# EAGLE design controller7connector (EAGLE 7.7.0)
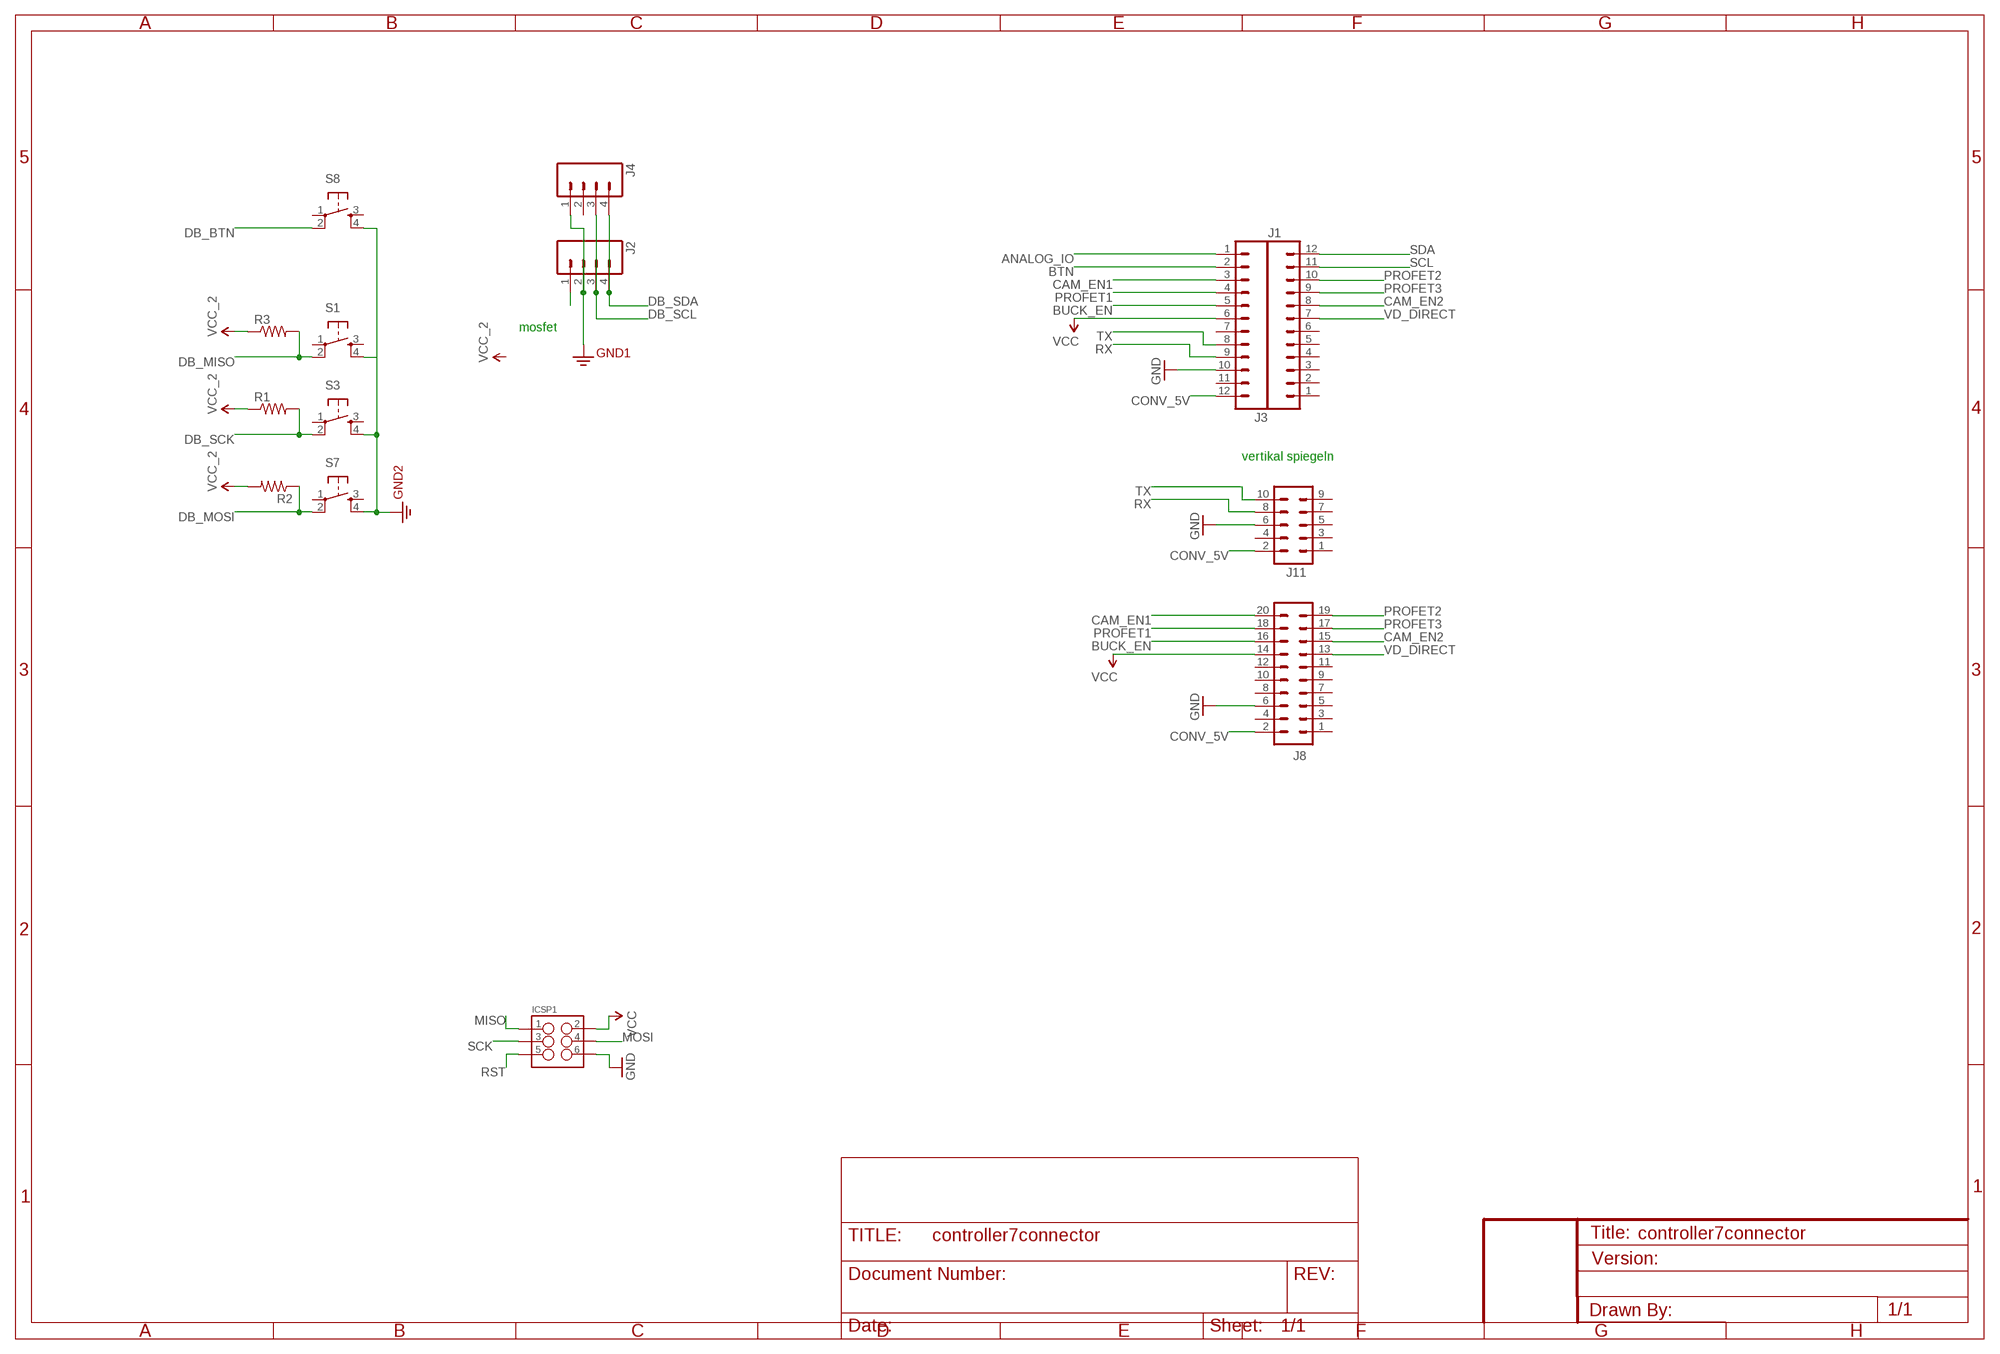
[diagram p0: schematic, sheet 1]

## Parts
ICSP1  M03X2FEMALE  [2X3]
J1  M12PTH  [1X12]
J2  M04LOCK  [1X04_LOCK]
J3  M12PTH  [1X12]
J4  M04LOCK  [1X04_LOCK]
J8  M10X2  [2X10]
J11  M05X2NO_SILK  [2X5_NOSILK]
R1  RESISTOR1206  [1206]
R2  RESISTOR1206  [1206]
R3  RESISTOR1206  [1206]
S1  TAC_SWITCHPTH  [TACTILE-PTH]
S3  TAC_SWITCHPTH  [TACTILE-PTH]
S7  TAC_SWITCHPTH  [TACTILE-PTH]
S8  TAC_SWITCHPTH  [TACTILE-PTH]

## Nets
3.3V [power]: J2.2 J4.1 S1.4 S3.4 S7.4 S8.4 ; supply symbol labelled GND2
ANALOG_IO: J3.1
BTN: J3.2
BUCK_EN: J3.5 J8.16
CAM_EN1: J3.3 J8.20
CAM_EN2: J1.8 J8.15
CONV_5V [power]: J3.12 J8.2 J11.2
DB_BTN: S8.2
DB_MISO: R3.2 S1.2
DB_MOSI: R2.1 S7.2
DB_SCK: R1.2 S3.2
DB_SCL: J2.3 J4.3
DB_SDA: J2.4 J4.4
GND [power]: ICSP1.6 J3.10 J8.6 J11.6
MISO: ICSP1.1
MOSI: ICSP1.4
N$1 [camera_power]: J2.1
PROFET1: J3.4 J8.18
PROFET2: J1.10 J8.19
PROFET3: J1.9 J8.17
RST: ICSP1.5
RX: J3.9 J11.8
SCK: ICSP1.3
SCL: J1.11
SDA: J1.12
TX: J3.8 J11.10
VCC [power]: ICSP1.2 J3.6 J8.14
VCC_2 [power]: R1.1 R2.2 R3.1
VD_DIRECT: J1.7 J8.13
Unconnected: J1.1 J1.2 J1.3 J1.4 J1.5 J1.6 J3.7 J3.11 J4.2 J8.1 J8.3 J8.4 J8.5 J8.7 J8.8 J8.9 J8.10 J8.11 J8.12 J11.1 J11.3 J11.4 J11.5 J11.7 J11.9 S1.1 S1.3 S3.1 S3.3 S7.1 S7.3 S8.1 S8.3

## Notes on the sheet
- mosfet
- vertikal spiegeln

## Library data of the parts
ICSP1 = SparkFun-Connectors:M03X2: 2x3 .1" header. Shrouded, with keying- CONN-10681 SMT- CONN-11415 Pogo pins- HW-11044; PROD_ID: CONN-11566; VALUE: FEMALE 2x3
J1 J3 = SparkFun-Connectors:M12: Header 12 Standard 12-pin 0.1" header. Use with straight break away headers (SKU : PRT-00116), right angle break away headers (PRT-00553), swiss pins (PRT-00743), machine pins (PRT-00117), and female headers (PRT-00115).
J2 J4 = SparkFun-Connectors:M04: Header 4 Standard 4-pin 0.1" header. Use with straight break away headers (SKU : PRT-00116), right angle break away headers (PRT-00553), swiss pins (PRT-00743), machine pins (PRT-00117), and female headers (PRT-00115). Molex polarized connector foot print use with SKU : PRT-08231 with associated crimp pins and housings. 1MM SMD Version SKU: PRT-10208; PROD_ID: CONN-09696
J8 = SparkFun-Connectors:M10X2: This was SPECIALLY designed to be used with our Graphic LCD Backpack. Be sure you want to use this! It is not only staggered on each line of header holes, but IT IS ALSO offset of the center point of the top and bottom lines by 5 mil. This causes the headers to lock into place on the "standard" footprint on the LCD screen. The extra squares on the tdocu layer are there simply to reference other pins (if you were to actually populate a longer header than ten long - this is what we do with the backpacks).
J11 = SparkFun-Connectors:M05X2: Header 5x2 Standard 10-pin dual row 0.1" header. Commonly used with AVR-ISP. Use with Spark Fun Electronics SKU: PRT-00778
R1-R3 = SparkFun-Passives:RESISTOR: Resistor Basic schematic elements and footprints for 0603, 1206, and PTH resistors.
S1 S3 S7 S8 = SparkFun-Retired:TAC_SWITCH: Momentary Switch Button commonly used for reset or general input. Spark Fun Electronics SKU : COM-00097 SMT- SWCH-08247

## Net classes
0 default: width 0.254 mm, clearance 0.254 mm
1 power: width 0.356 mm, clearance 0.254 mm
2 camera_power: width 0.66 mm, clearance 0.254 mm
3 usbsignal: width 0.254 mm, clearance 0.203 mm

## Board
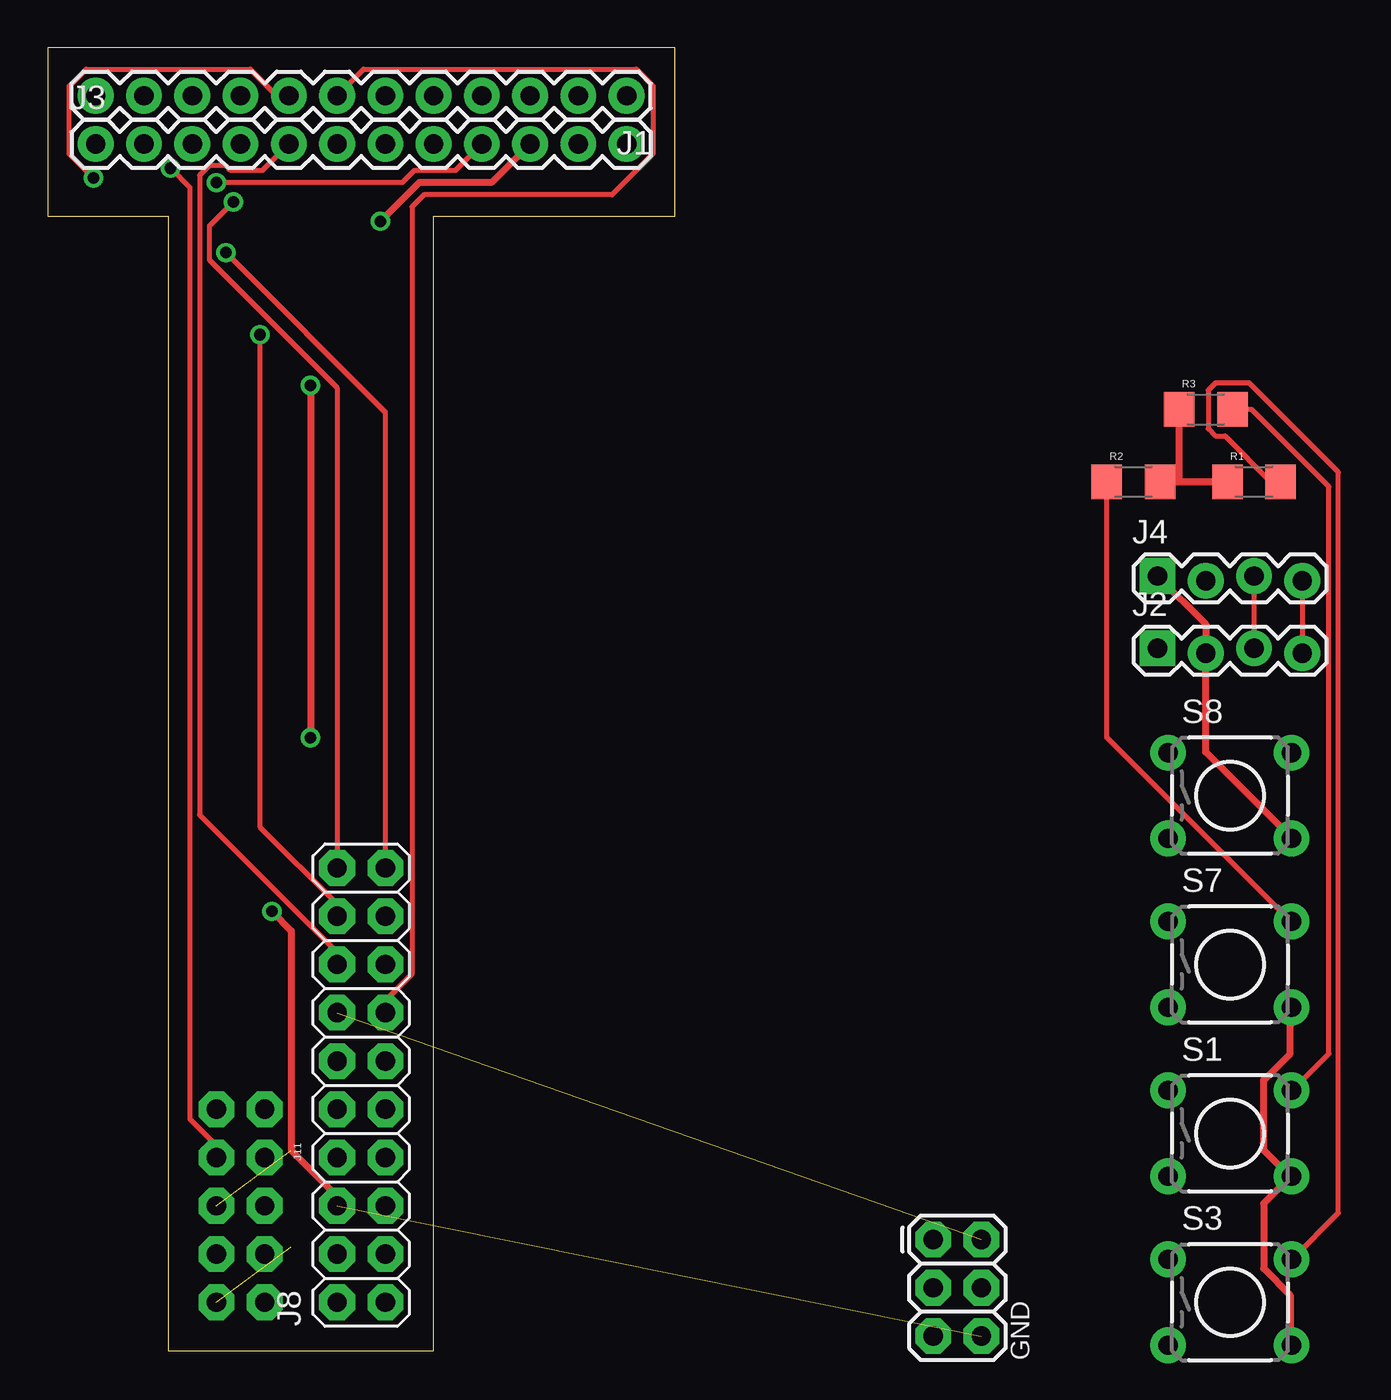
[diagram p1: board, top side]
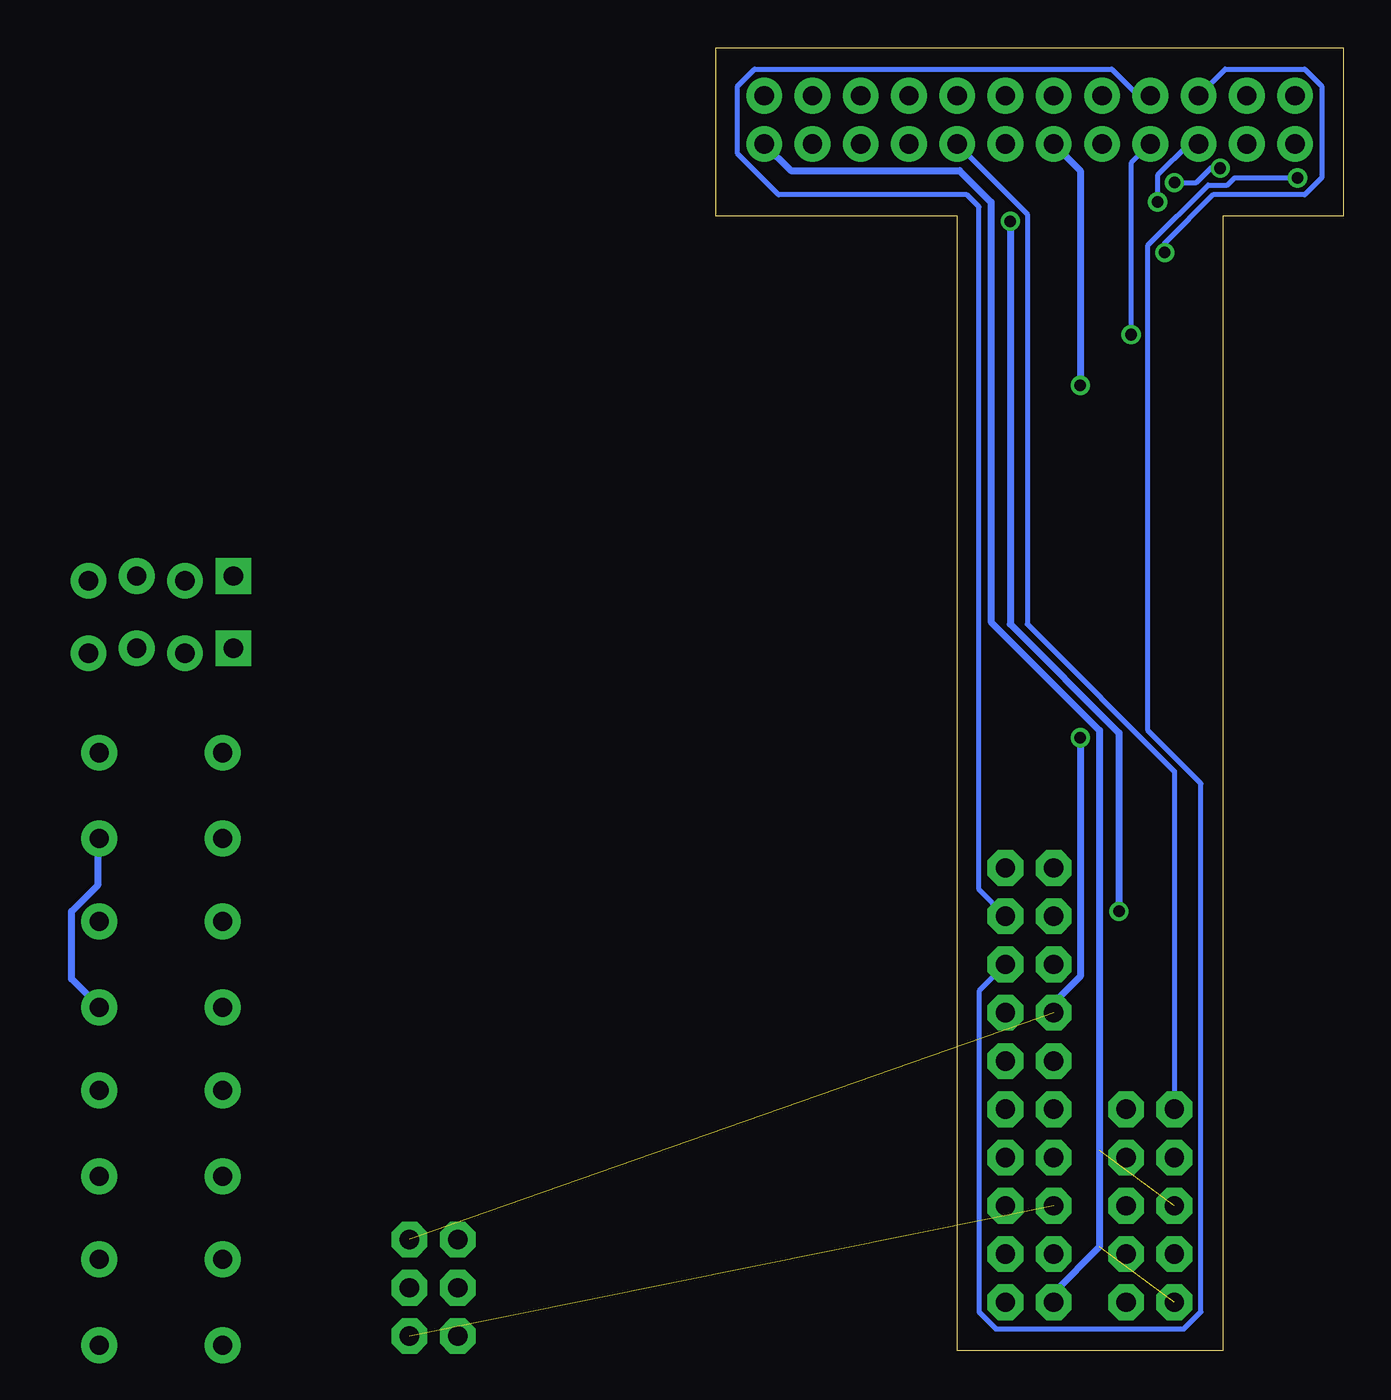
[diagram p2: board, bottom side, seen from below]

Size 33.02 x 68.58 mm. Coordinates in mm from the lower left corner, seen from the top.
Outline: 33.02,68.58 0,68.58 0,59.69 6.35,59.69 6.35,0 20.32,0 20.32,59.69 33.02,59.69 33.02,68.58
Copper layers (1*16): Top 0.035mm / dielectric 1.5mm / Bottom 0.035mm
Design rules "default": minimum track width 10mil, minimum drill 24mil, track to track 8mil, track to pad 8mil, pad to pad 8mil, via to via 8mil, smd to smd 8mil, copper to edge 40mil, drill to drill 8mil, minimum pad ring 10mil, minimum via ring 8mil, stop-mask expansion 4mil, vias tented up to drill 0mil, thermal gap 10mil

### Footprints (pad centres in the part's own frame; a part is rotated, then mirrored left to right if it is on the bottom)
2X3 = drill 1.016 pad 1.88 octagon: 1 0,0; 2 0,2.54; 3 2.54,0; 4 2.54,2.54; 5 5.08,0; 6 5.08,2.54
1X12 = drill 1.016 pad 1.88: 1 0,0; 2 2.54,0; 3 5.08,0; 4 7.62,0; 5 10.16,0; 6 12.7,0; 7 15.24,0; 8 17.78,0; 9 20.32,0; 10 22.86,0; 11 25.4,0; 12 27.94,0
1X04_LOCK = drill 1.016 pad 1.88 square: 1 0,0.127 | drill 1.016 pad 1.88: 2 2.54,-0.127; 3 5.08,0.127; 4 7.62,-0.127
2X10 = drill 1.016 pad 1.88 octagon: 1 -11.43,-1.27; 2 -11.43,1.27; 3 -8.89,-1.27; 4 -8.89,1.27; 5 -6.35,-1.27; 6 -6.35,1.27; 7 -3.81,-1.27; 8 -3.81,1.27; 9 -1.27,-1.27; 10 -1.27,1.27; 11 1.27,-1.27; 12 1.27,1.27; 13 3.81,-1.27; 14 3.81,1.27; 15 6.35,-1.27; 16 6.35,1.27; 17 8.89,-1.27; 18 8.89,1.27; 19 11.43,-1.27; 20 11.43,1.27
2X5_NOSILK = drill 1.016 pad 1.88 octagon: 1 -1.27,5.08; 2 1.27,5.08; 3 -1.27,2.54; 4 1.27,2.54; 5 -1.27,0; 6 1.27,0; 7 -1.27,-2.54; 8 1.27,-2.54; 9 -1.27,-5.08; 10 1.27,-5.08
1206 = smd 1.6 x 1.8: 1 -1.4,0; 2 1.4,0
TACTILE-PTH = drill 1.016 pad 1.88: 1 -3.251,2.261; 2 3.251,2.261; 3 -3.251,-2.261; 4 3.251,-2.261

### Placement (x,y rotation side)
ICSP1  46.61,5.84 270 top  (outside the outline)
J1  30.48,66.04 180 top
J2  58.42,36.83 0 top  (outside the outline)
J3  2.54,63.5 0 top
J4  58.42,40.64 0 top  (outside the outline)
J8  16.51,13.97 90 top
J11  10.16,7.62 180 top
R1  63.5,45.72 0 top  (outside the outline)
R2  57.15,45.72 0 top  (outside the outline)
R3  60.96,49.53 0 top  (outside the outline)
S1  62.23,11.43 0 top  (outside the outline)
S3  62.23,2.54 0 top  (outside the outline)
S7  62.23,20.32 0 top  (outside the outline)
S8  62.23,29.21 0 top  (outside the outline)

### Tracks (layer width: path | path; a pad name or v marks a point on that pad's centre or on a via)
3.3V
  Top 0.356: J4.1 60.96,38.23 J2.2 60.96,31.5 65.41,27.05 S8.4 | S3.4 65.41,0.38 65.41,2.92 64.01,4.32 64.01,7.75 65.41,9.14 S1.4 65.28,9.27 64.01,10.54 64.01,14.22 65.41,15.62 65.41,18.03 S7.4
  Bottom 0.356: S8.4 65.53,26.92 65.53,24.51 66.93,23.11 66.93,19.56 65.53,18.16 S7.4
BUCK_EN
  Top 0.254: J8.16 15.24,20.95 8,28.19 8,61.85 8.51,62.36 9.4,62.36 9.65,62.1 11.3,62.1 J3.5
CAM_EN1  (via drill 0.61)
  Top 0.254: J8.20 15.24,50.67 8.51,57.4 8.51,59.18 v9.78,60.45
  Bottom 0.254: v9.78,60.45 9.78,61.85 8.13,63.5 J3.3
CAM_EN2  (via drill 0.61)
  Top 0.254: J1.8 12.07,66.04 10.67,67.44 2.03,67.44 1.14,66.55 1.14,62.99 v2.41,61.72
  Bottom 0.254: v2.41,61.72 5.71,61.72 6.1,61.34 7.11,61.34 10.29,58.17 10.29,32.64 7.49,29.84 7.49,2.03 8.38,1.14 18.29,1.14 19.18,2.03 19.18,18.92 J8.15
CONV_5V  (1 unrouted)
  Bottom 0.356: J8.2 15.24,3.05 12.83,5.46 12.83,32.64 18.54,38.35 18.54,60.45 20.19,62.1 29.08,62.1 J3.12
DB_MISO
  Top 0.254: R3.2 63.37,49.53 67.44,45.47 67.44,15.62 65.53,13.72 S1.2
DB_MOSI
  Top 0.254: R2.1 55.75,32.26 65.41,22.61 S7.2
DB_SCK
  Top 0.254: R1.2 64.39,45.72 61.98,48.13 61.47,48.13 61.09,48.51 61.09,50.55 61.47,50.93 63.25,50.93 67.94,46.23 67.94,7.24 65.53,4.83 S3.2
DB_SCL
  Top 0.254: J4.3 J2.3
DB_SDA
  Top 0.254: J4.4 J2.4
GND  (via drill 0.61)  (2 unrouted)
  Top 0.356: J8.6 15.24,8.13 12.83,10.54 12.83,22.1 v11.81,23.11 | v17.53,59.44 19.56,61.47 23.37,61.47 J3.10
  Bottom 0.356: v11.81,23.11 11.81,32.51 17.53,38.23 v17.53,59.44
PROFET1  (via drill 0.61)
  Top 0.254: J8.18 15.24,23.49 11.18,27.56 v11.18,53.47
  Bottom 0.254: v11.18,53.47 11.18,62.48 J3.4
PROFET2  (via drill 0.61)
  Top 0.254: J8.19 17.78,49.4 v9.4,57.79
  Bottom 0.254: v9.4,57.79 9.4,58.29 6.86,60.83 2.03,60.83 1.14,61.72 1.14,66.55 2.03,67.44 6.22,67.44 J1.10
PROFET3
  Bottom 0.254: J1.9 10.8,66.04 12.19,67.44 30.99,67.44 31.88,66.55 31.88,62.99 29.72,60.83 19.81,60.83 19.18,60.2 19.18,24.26 J8.17
RX  (via drill 0.61)
  Top 0.254: J11.8 8.89,10.79 7.49,12.19 7.49,61.21 v6.48,62.23 | v8.89,61.47 18.67,61.47 19.3,62.1 21.46,62.1 J3.9
  Bottom 0.254: v6.48,62.23 6.98,62.23 7.75,61.47 v8.89,61.47
TX
  Bottom 0.254: J11.10 8.89,30.48 16.64,38.23 16.64,59.82 J3.8
VCC  (via drill 0.61)  (1 unrouted)
  Top 0.356: v13.84,50.8 v13.84,32.26
  Bottom 0.356: J8.14 15.24,18.29 13.84,19.69 v13.84,32.26 | v13.84,50.8 13.84,62.1 J3.6
VCC_2
  Top 0.356: R1.1 59.56,45.72 | 59.56,45.72 R2.2 | 59.56,45.72 R3.1
VD_DIRECT
  Top 0.254: J8.13 17.78,18.41 19.18,19.81 19.18,60.2 19.81,60.83 29.72,60.83 31.88,62.99 31.88,66.55 30.99,67.44 16.64,67.44 J1.7

### Text on the board
tPlace: GND